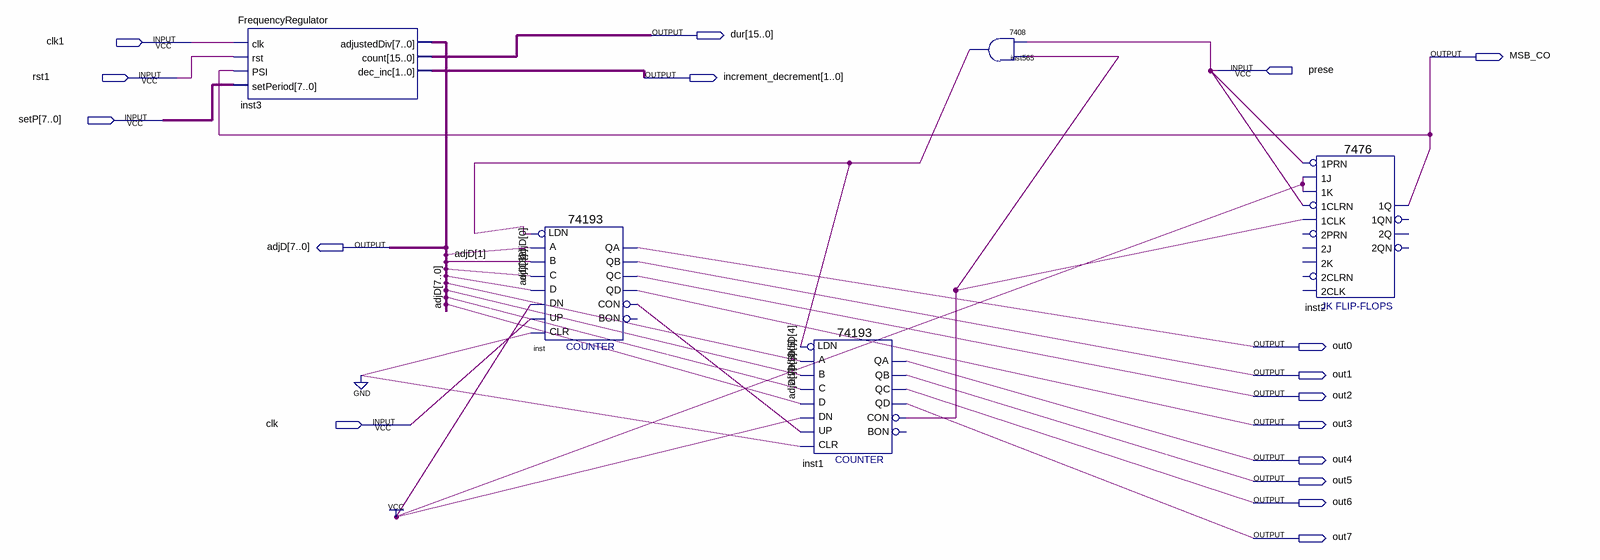
[diagram p0: schematic sheet]
// Quartus schematic fc2.bdf as structural Verilog: 5 symbols, 17 pins
module fc2 (
  input  clk1,
  input  prese,
  input  rst1,
  input  [7:0] setP,
  input  clk,
  output [15:0] dur,
  output MSB_CO,
  output [1:0] increment_decrement,
  output [7:0] adjD,
  output out0,
  output out1,
  output out2,
  output out3,
  output out4,
  output out5,
  output out6,
  output out7
);

  wire inst1_con, inst565_1, inst_con;

  FrequencyRegulator inst3 (
    .clk(clk1), .rst(rst1), .PSI(MSB_CO), .setPeriod(setP), .adjustedDiv(adjD), .count(dur),
    .dec_inc(increment_decrement));
  \74193  inst (
    .D(adjD[3]), .C(adjD[2]), .B(adjD[1]), .A(adjD[0]), .CLR(1'b0), .UP(clk), .DN(1'b1), .LDN(inst565_1),
    .QB(out1), .QA(out0), .CON(inst_con), .QD(out3), .QC(out2));  // open: BON
  \74193  inst1 (
    .D(adjD[7]), .C(adjD[6]), .B(adjD[5]), .A(adjD[4]), .CLR(1'b0), .UP(inst_con), .DN(1'b1),
    .LDN(inst565_1), .QB(out5), .QA(out4), .CON(inst1_con), .QD(out7), .QC(out6));  // open: BON
  \7408  inst565 (.\3 (inst1_con), .\2 (prese), .\1 (inst565_1));
  \7476  inst2 (
    .\1J (1'b1), .\1K (1'b1), .\1PRN (prese), .\1CLK (inst1_con), .\1CLRN (prese), .\1Q (MSB_CO));  // open: 2PRN, 2J, 2K, 2CLRN, 2CLK, 2QN, 2Q, 1QN
endmodule
